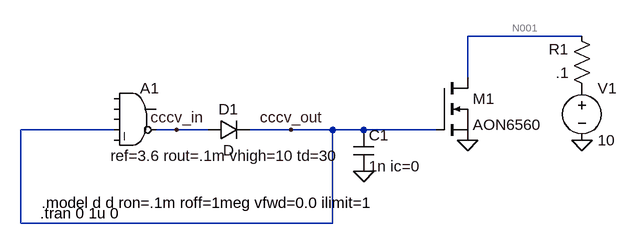
[diagram p0: schematic NMOS Gate Charge Test.asc]
NMOS Gate Charge Test.asc, the LTspice schematic file:
Version 4
SHEET 1 912 680
WIRE 864 32 688 32
WIRE 688 96 688 32
WIRE 144 176 0 176
WIRE 240 176 208 176
WIRE 288 176 240 176
WIRE 416 176 352 176
WIRE 480 176 416 176
WIRE 528 176 480 176
WIRE 640 176 528 176
WIRE 0 320 0 176
WIRE 480 320 480 176
WIRE 480 320 0 320
FLAG 240 176 cccv_in
FLAG 416 176 cccv_out
FLAG 688 192 0
FLAG 528 240 0
FLAG 864 192 0
SYMBOL Digital\\and 176 96 R0
WINDOW 3 -38 120 Left 2
SYMATTR InstName A1
SYMATTR Value ref=3.6 rout=.1m vhigh=10 td=30
SYMBOL diode 288 192 R270
WINDOW 0 32 32 VTop 2
WINDOW 3 0 32 VBottom 2
SYMATTR InstName D1
SYMBOL nmos 640 96 R0
SYMATTR InstName M1
SYMATTR Value AON6560
SYMBOL cap 512 176 R0
SYMATTR InstName C1
SYMATTR Value 1n ic=0
SYMBOL voltage 864 96 R0
WINDOW 123 0 0 Left 0
WINDOW 39 0 0 Left 0
SYMATTR InstName V1
SYMATTR Value 10
SYMBOL res 880 128 R180
WINDOW 0 36 76 Left 2
WINDOW 3 36 40 Left 2
SYMATTR InstName R1
SYMATTR Value .1
TEXT 32 288 Left 2 !.model d d ron=.1m roff=1meg vfwd=0.0 ilimit=1
TEXT 30 304 Left 2 !.tran 0 1u 0

The netlist it stands for:
* NMOS Gate Charge Test.asc
A1 0 0 0 cccv_out 0 cccv_in 0 0 AND ref=3.6 rout=.1m vhigh=10 td=30
D1 cccv_in cccv_out D
M1 N001 cccv_out 0 0 AON6560
C1 cccv_out 0 1n ic=0
V1 P001 0 10
R1 P001 N001 .1
.model D D
.lib standard.dio
.model NMOS NMOS
.model PMOS PMOS
.lib standard.mos
.model d d ron=.1m roff=1meg vfwd=0.0 ilimit=1
.tran 0 1u 0
.backanno
.end

* Results of the author's LTspice run, read from the files saved beside the schematic
* Operating Point, zero values left out:
*   V(cccv_out) = 1 mV
*   V(cccv_in) = 10 V
*   V(n001) = 10 V
*   V(p001) = 10 V
*   Id(M1) = 24.7 pA
*   Is(M1) = -24.7 pA
*   I(C1) = 1 A
*   I(D1) = 1 A
*   I(R1) = 47.59 pA
*   I(V1) = -47.59 pA
*   I8(A1) = 1 A
*   I6(A1) = -1 A
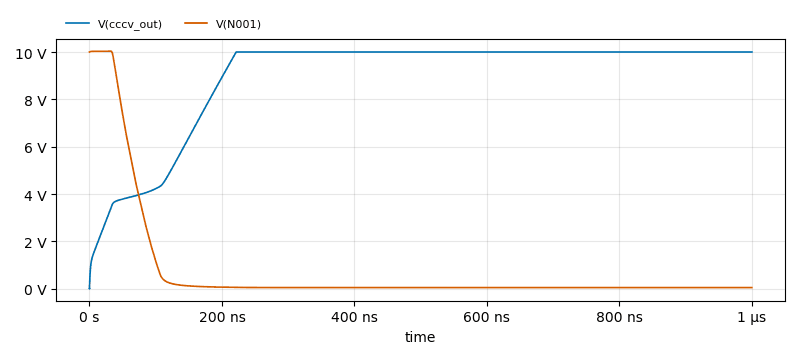
[diagram p1: Transient Analysis of NMOS Gate Charge Test.asc, plotted from the saved traces]
* Transient Analysis, 1 run:
*   V(cccv_out): min 9.774 µV, max 10 V, average 8.965 V, rms 9.237 V, last 10 V
*   V(N001): min 53.54 mV, max 10.03 V, average 744.6 mV, rms 2.375 V, last 53.54 mV